# Altium schematic sheet Wand.SchDoc
size A3
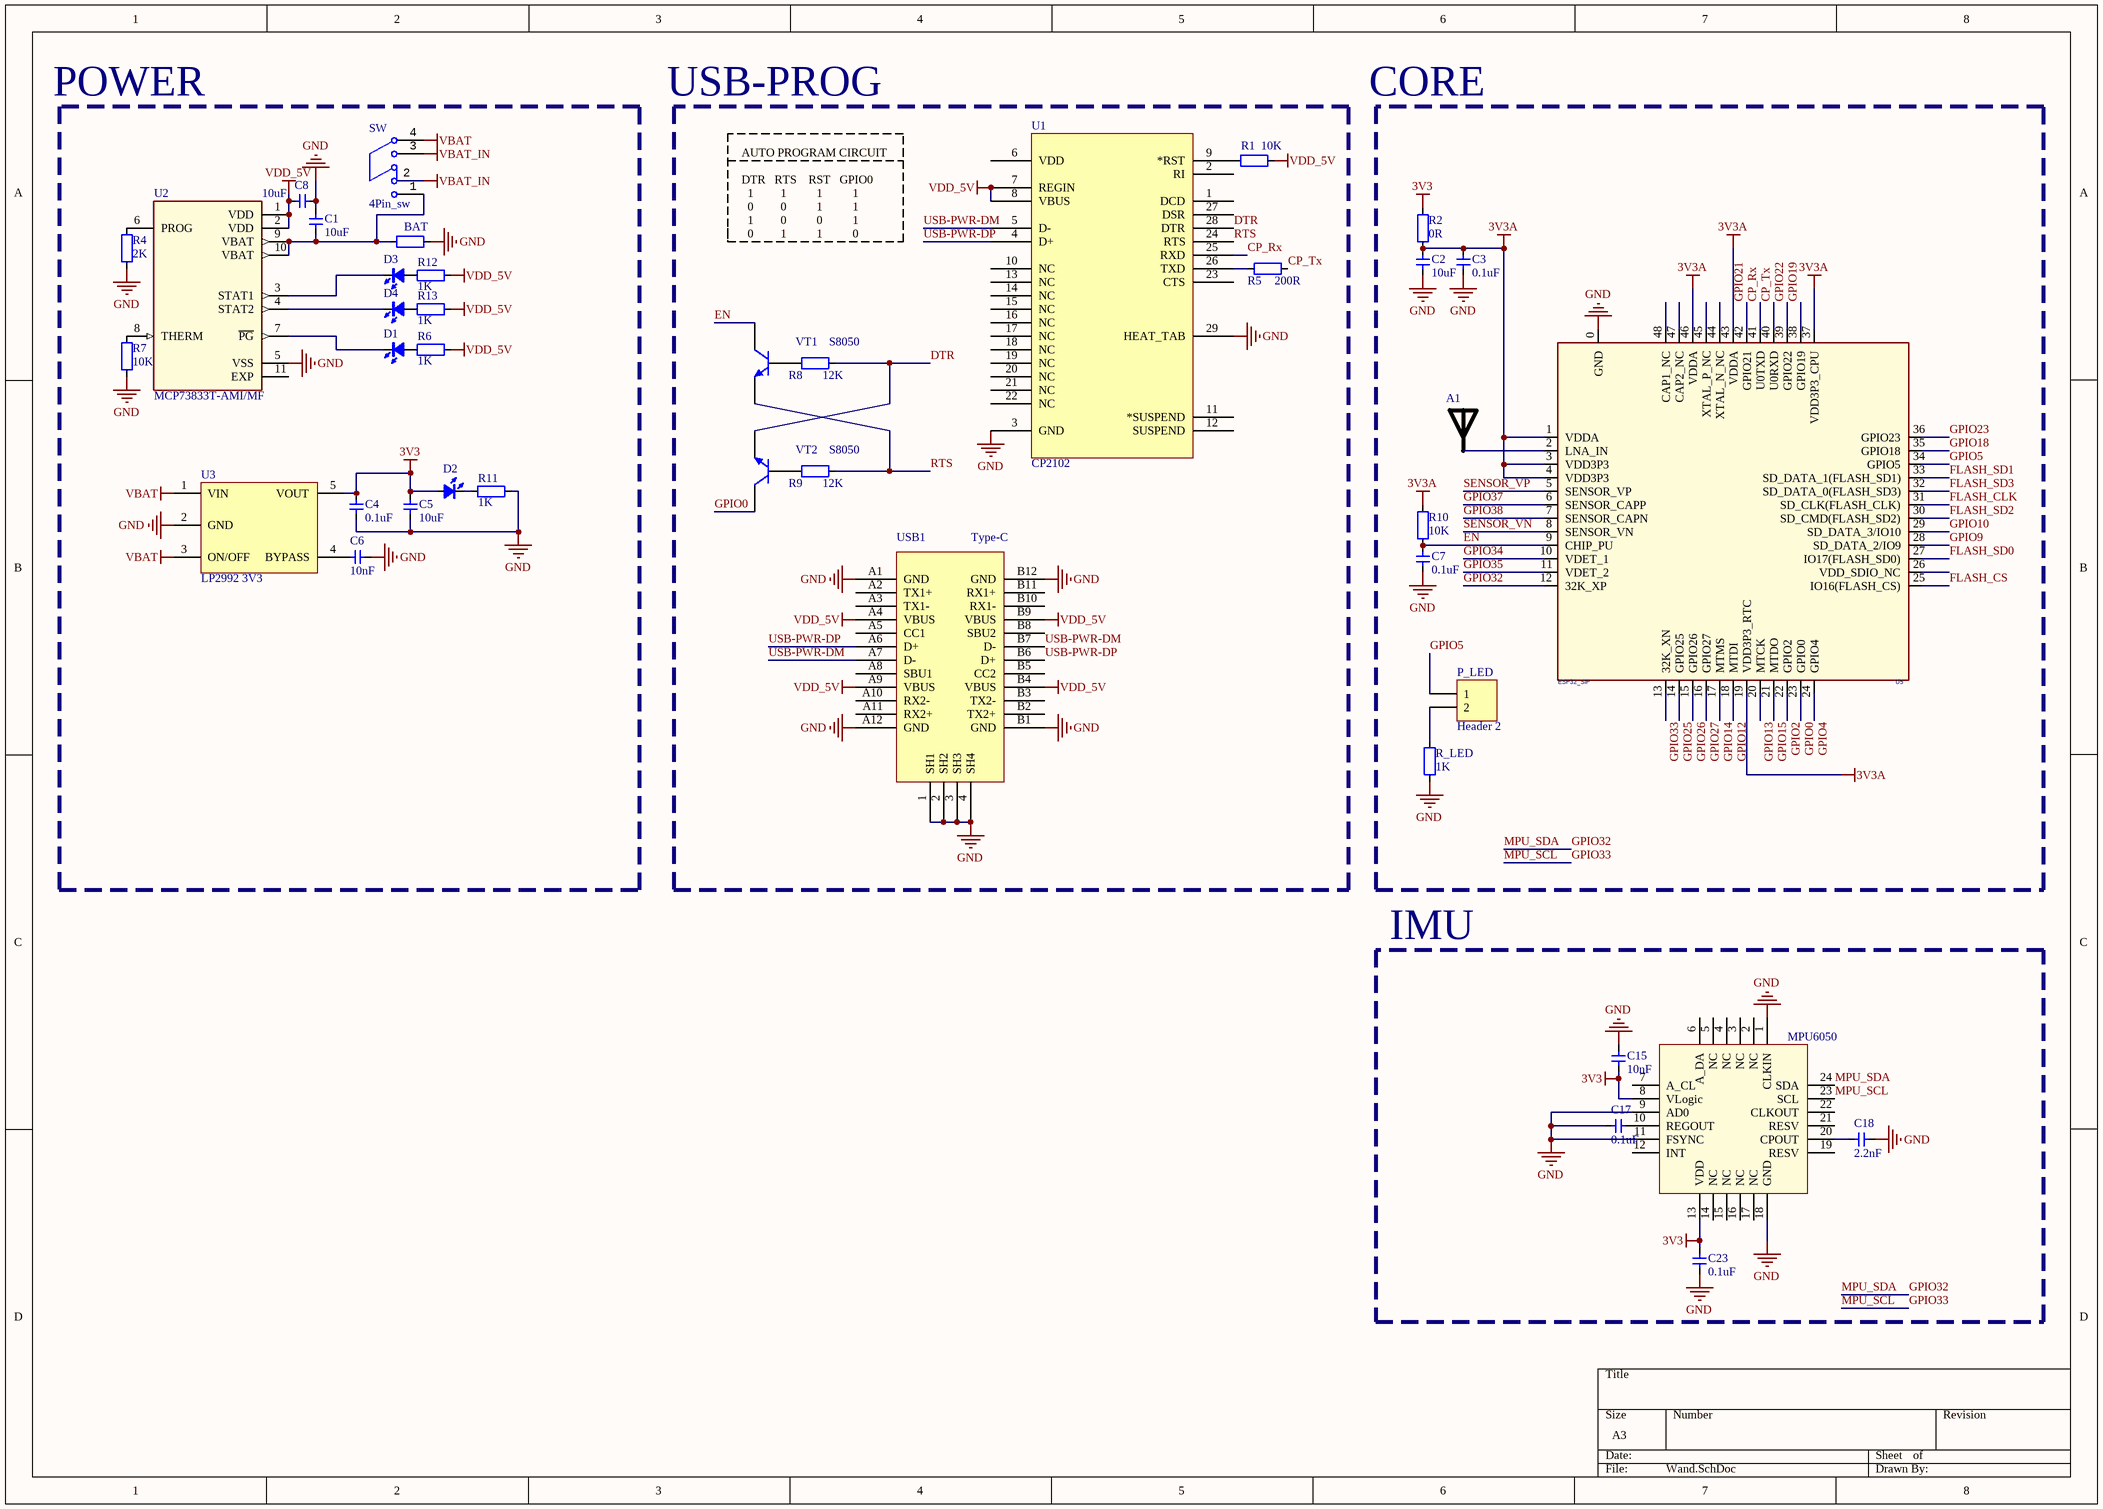
[diagram p0: Wand.SchDoc]

## Parts
A1  RAINSUN  [ANT-Rainsun-AN5120]  (value not drawn)
C1  10uF  [0603-CAP]
C2  10uF  [0603-CAP]
C3  0.1uF  [CAP_0402]
C4  0.1uF  [CAP_0402]
C5  10uF  [0603-CAP]
C6  10nF  [CAP_0402]
C7  0.1uF  [CAP_0402]
C8  10uF  [0603-CAP]
C15  10nF  [CAP_0402]
C17  0.1uF  [CAP_0402]
C18  2.2nF  [CAP_0402]
C23  0.1uF  [CAP_0402]
D1  color?  [LED_0402_RED]  (value not drawn)
D2  color?  [LED_0402_RED]  (value not drawn)
D3  color?  [LED_0402_RED]  (value not drawn)
D4  color?  [LED_0402_RED]  (value not drawn)
P_LED  Header 2  [HDR1X2]
R1  10K  [RES_0402]
R2  0R  [RES_0402]
R3  BAT  [0805-L]
R4  2K  [RES_0402]
R5  200R  [RES_0402]
R6  1K  [RES_0402]
R7  10K  [RES_0402]
R8  12K  [RES_0402]
R9  12K  [RES_0402]
R10  10K  [RES_0402]
R11  1K  [RES_0402]
R12  1K  [RES_0402]
R13  1K  [RES_0402]
R_LED  1K  [RES_0402]
SW  4Pin_sw  [4pin_SW]
U1  CP2102  [QFN-28]
U2  MCP73833T-AMI/MF  [QFN_10_L]
U3  LP2992 3V3  [SOT23-5]
U5  ESP32_SIP  [QFN-48_7X7]
U8  MPU6050  [QFN-24]
USB1  Type-C  [Type-C-TOP]
VT1  S8050  [SMT_TRIODE_NPN]
VT2  S8050  [SMT_TRIODE_NPN]

## Blocks framed on the sheet
IMU: C15 C17 C18 C23 U8

## Nets
3V3: C4.2 C5.2 C15.1 C23.2 D2.1(A) R2.1 U3.5(VOUT) U8.8(VLogic) U8.13(VDD)
3V3A: C2.2 C3.2 R2.2 R10.1 U5.1(VDDA) U5.3(VDD3P3) U5.4(VDD3P3) U5.19(VDD3P3_RTC) U5.37(VDD3P3_CPU) U5.43(VDDA) U5.46(VDDA)
GND: C1.2 C2.1 C3.1 C4.1 C5.1 C6.1 C7.2 C8.1 C15.2 C17.2 C18.1 C23.1 R3.2 R4.1 R7.1 R11.1 R_LED.2 U1.3(GND) U1.29(HEAT_TAB) U2.5(VSS) U3.2(GND) U5.0(GND) U8.1(CLKIN) U8.9(AD0) U8.11(FSYNC) U8.18(GND) USB1.1(SH1) USB1.2(SH2) USB1.3(SH3) USB1.4(SH4) USB1.A1(GND) USB1.A12(GND) USB1.B1(GND) USB1.B12(GND)
VBAT: SW.4 U3.1(VIN) U3.3(ON/OFF)
VBAT_IN: SW.2 SW.3
VDD_5V: C8.2 R1.1 R6.1 R12.1 R13.1 U1.7(REGIN) U1.8(VBUS) U2.1(VDD) U2.2(VDD) USB1.A4(VBUS) USB1.A9(VBUS) USB1.B4(VBUS) USB1.B9(VBUS)
CP_Rx: U1.25(RXD) U5.41(U0TXD)
CP_Tx: R5.1 U5.40(U0RXD)
DTR: R8.1 U1.28(DTR) VT2.2(E)
EN: C7.1 R10.2 U5.9(CHIP_PU) VT1.3(C)
FLASH_CLK: U5.31(SD_CLK(FLASH_CLK))
FLASH_CS: U5.25(IO16(FLASH_CS))
FLASH_SD0: U5.27(IO17(FLASH_SD0))
FLASH_SD1: U5.33(SD_DATA_1(FLASH_SD1))
FLASH_SD2: U5.30(SD_CMD(FLASH_SD2))
FLASH_SD3: U5.32(SD_DATA_0(FLASH_SD3))
GPIO0: U5.23(GPIO0) VT2.3(C)
GPIO2: U5.22(GPIO2)
GPIO4: U5.24(GPIO4)
GPIO5: P_LED.1 U5.34(GPIO5)
GPIO9: U5.28(SD_DATA_2/IO9)
GPIO10: U5.29(SD_DATA_3/IO10)
GPIO12: U5.18(MTDI)
GPIO13: U5.20(MTCK)
GPIO14: U5.17(MTMS)
GPIO15: U5.21(MTDO)
GPIO18: U5.35(GPIO18)
GPIO19: U5.38(GPIO19)
GPIO21: U5.42(GPIO21)
GPIO22: U5.39(GPIO22)
GPIO23: U5.36(GPIO23)
GPIO25: U5.14(GPIO25)
GPIO26: U5.15(GPIO26)
GPIO27: U5.16(GPIO27)
GPIO32: U5.12(32K_XP) U8.24(SDA)  [also labelled MPU_SDA]
GPIO33: U5.13(32K_XN) U8.23(SCL)  [also labelled MPU_SCL]
GPIO34: U5.10(VDET_1)
GPIO35: U5.11(VDET_2)
GPIO37: U5.6(SENSOR_CAPP)
GPIO38: U5.7(SENSOR_CAPN)
RTS: R9.1 U1.24(RTS) VT1.2(E)
SENSOR_VN: U5.8(SENSOR_VN)
SENSOR_VP: U5.5(SENSOR_VP)
USB-PWR-DM: U1.5(D-) USB1.A7(D-) USB1.B7(D-)
USB-PWR-DP: U1.4(D+) USB1.A6(D+) USB1.B6(D+)
NetA1_1: A1.1 U5.2(LNA_IN)
NetC1_1: C1.1 R3.1 SW.1 U2.9(VBAT) U2.10(VBAT)
NetC6_2: C6.2 U3.4(BYPASS)
NetC17_1: C17.1 U8.10(REGOUT)
NetC18_2: C18.2 U8.20(CPOUT)
NetD1_1: D1.1(A) R6.2
NetD1_2: D1.2(K) U2.7(~{PG})
NetD2_2: D2.2(K) R11.2
NetD3_1: D3.1(A) R12.2
NetD3_2: D3.2(K) U2.3(STAT1)
NetD4_1: D4.1(A) R13.2
NetD4_2: D4.2(K) U2.4(STAT2)
NetP_LED_2: P_LED.2 R_LED.1
NetR1_2: R1.2 U1.9(*RST)
NetR4_2: R4.2 U2.6(PROG)
NetR5_2: R5.2 U1.26(TXD)
NetR7_2: R7.2 U2.8(THERM)
NetR8_2: R8.2 VT1.1(B)
NetR9_2: R9.2 VT2.1(B)

Not connected (* = marked no-connect by the designer): U1 1(DCD) 2(RI) 6(VDD) 10(NC) 11(*SUSPEND) 12(SUSPEND) 13(NC) 14(NC) 15(NC) 16(NC) 17(NC) 18(NC) 19(NC) 20(NC) 21(NC) 22(NC) 23(CTS) 27(DSR); U2 11(EXP); U5 26(VDD_SDIO_NC) 44(XTAL_N_NC) 45(XTAL_P_NC) 47(CAP2_NC) 48(CAP1_NC); U8 2(NC) 3(NC) 4(NC) 5(NC) 6(A_DA) 7(A_CL) 12(INT) 14(NC) 15(NC) 16(NC) 17(NC) 19(RESV) 21(RESV) 22(CLKOUT); USB1 A2(TX1+) A3(TX1-) A5(CC1) A8(SBU1) A10(RX2-) A11(RX2+) B2(TX2+) B3(TX2-) B5(CC2) B8(SBU2) B10(RX1-) B11(RX1+)

## Notes on the sheet
- POWER
- USB-PROG
- CORE
- AUTO PROGRAM CIRCUIT
  DTR   RTS    RST   GPIO0
  1         1          1          1
  0         0          1          1
  1         0          0          1
  0         1          1          0

## Library data of the parts
A1 = ANT-Rainsun-AP5120
C1 C2 C5 C8 = 电容-0603: Capacitor; Value: 0.1u
C3 C4 C6 C7 C15 C17 C18 C23 = 电容-0402: Capacitor; Value: 0.1u
D1-D4 = LED_0402: LED; Type: 0402; Value: color?
P_LED = Header 2: Header, 2-Pin; LatestRevisionDate: 17-Jul-2002; LatestRevisionNote: Re-released for DXP Platform.; Publisher: Altium Limited
R1 R2 R4-R13 R_LED = 电阻-0402: Resistor; Value: 22R
R3 = 电阻-0805: Resistor; Value: 22R
U1 = CP2102: USB转TTL; PART DESC: SINGLE-CHIP USB TO UART BRIDGE, QFN28, RoHS.; MFG #1: SILICON LABS; PART NUMBER: CP2102; Value: Value; RefDes: RefDes; Type: DEV
U2 = MCP73833T: Linear Charge Management Controller Li-Ion/Li-Pol 1mA 4.2V/4.35V/4.4V/4.5V 10-Pin DFN EP T/R; MF: Microchip; Availability: Unavailable; Package: DFN-10 Microchip; Price: None; SnapEDA_Link: https://www.snapeda.com/parts/MCP73833T-AMI/MF/Microchip/view-part/?ref=snap; MP: MCP73833T-AMI/MF; Value: *
U3 = LP2992: LDO
U5 = ESP32-PICO
U8 = MPU6050: 六轴传感器
USB1 = USB-Type-C-TOP
VT1 VT2 = SMT_TRIODE_NPN: Surface mount NPN transistor, package SOT-23